# Altium schematic sheet srv05-4.schdoc
size 54 x 45 mm
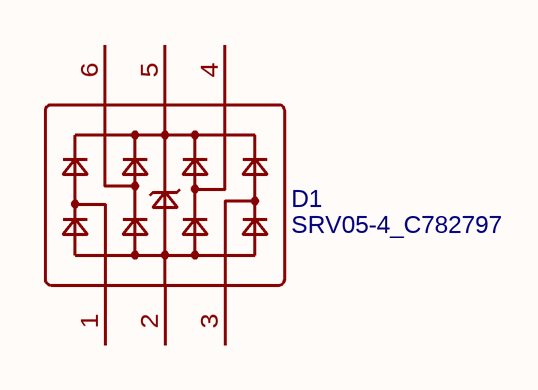
[diagram p0: srv05-4.schdoc]

## Parts
D1  SRV05-4_C782797  [SOT-23-6_L2.9-W1.6-P0.95-LS2.8-BR]

## Nets

Not connected (* = marked no-connect by the designer): D1 1 2 3 4 5 6

## Library data of the parts
D1 = SRV05-4_C782797: BOM_Manufacturer: SEMBO; Contributor: LCSC; BOM_Supplier: LCSC; BOM_Supplier Part: C782797; BOM_Manufacturer Part: SRV05-4; spicePre: D; spiceSymbolName: SRV05-4_C782797